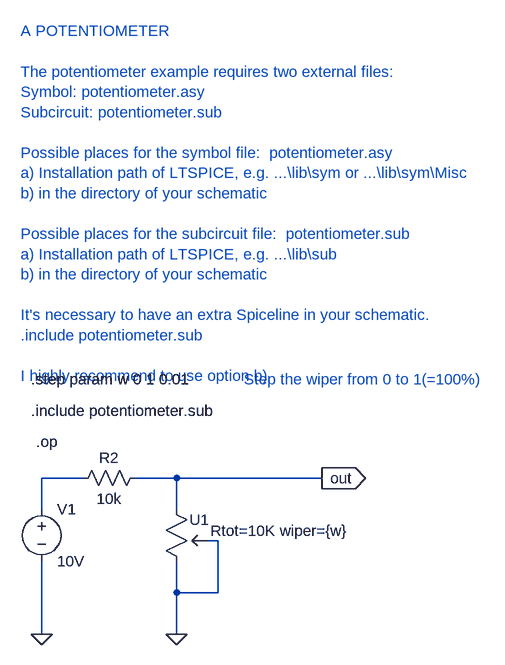
[diagram p0: schematic potentiometer_test_step1.asc]
potentiometer_test_step1.asc, the LTspice schematic file:
Version 4
SHEET 1 1076 680
WIRE 384 320 320 320
WIRE 528 320 464 320
WIRE 752 320 528 320
WIRE 320 368 320 320
WIRE 528 368 528 320
WIRE 592 416 576 416
WIRE 528 496 528 448
WIRE 592 496 592 416
WIRE 592 496 528 496
WIRE 320 560 320 448
WIRE 528 560 528 496
FLAG 320 560 0
FLAG 752 320 out
IOPIN 752 320 Out
FLAG 528 560 0
SYMBOL potentiometer 512 352 R0
WINDOW 3 68 49 Left 0
SYMATTR Value Rtot=10K wiper={w}
SYMATTR InstName U1
SYMBOL voltage 320 352 R0
SYMATTR InstName V1
SYMATTR Value 10V
SYMBOL res 368 336 R270
WINDOW 0 32 56 VTop 0
WINDOW 3 0 56 VBottom 0
SYMATTR InstName R2
SYMATTR Value 10k
TEXT 312 264 Left 0 !.op
TEXT 304 216 Left 0 !.include potentiometer.sub
TEXT 288 -368 Left 0 ;A POTENTIOMETER\n \nThe potentiometer example requires two external files: \nSymbol: potentiometer.asy\nSubcircuit: potentiometer.sub\n \nPossible places for the symbol file:  potentiometer.asy\na) Installation path of LTSPICE, e.g. ...\\lib\\sym or ...\\lib\\sym\\Misc\nb) in the directory of your schematic\n \nPossible places for the subcircuit file:  potentiometer.sub\na) Installation path of LTSPICE, e.g. ...\\lib\\sub\nb) in the directory of your schematic\n \nIt's necessary to have an extra Spiceline in your schematic.\n.include potentiometer.sub\n \nI highly recommend to use option b)
TEXT 304 168 Left 0 !.step param w 0 1 0.01
TEXT 632 168 Left 0 ;Step the wiper from 0 to 1(=100%)

The netlist it stands for:
* potentiometer_test_step1.asc
XU1 out 0 0 potentiometer Rtot=10K wiper={w}  ; pins A B C
V1 N001 0 10V
R2 N001 out 10k
.op
.include potentiometer.sub
* A POTENTIOMETER
* The potentiometer example requires two external files:
* Symbol: potentiometer.asy
* Subcircuit: potentiometer.sub
* Possible places for the symbol file:  potentiometer.asy
* a) Installation path of LTSPICE, e.g. ...\lib\sym or ...\lib\sym\Misc
* b) in the directory of your schematic
* Possible places for the subcircuit file:  potentiometer.sub
* a) Installation path of LTSPICE, e.g. ...\lib\sub
* b) in the directory of your schematic
* It's necessary to have an extra Spiceline in your schematic.
* .include potentiometer.sub
* I highly recommend to use option b)
.step param w 0 1 0.01
* Step the wiper from 0 to 1(=100%)
.backanno
.end